# EAGLE design ledboard_smallcon_vert_gndplane (EAGLE 6.4)
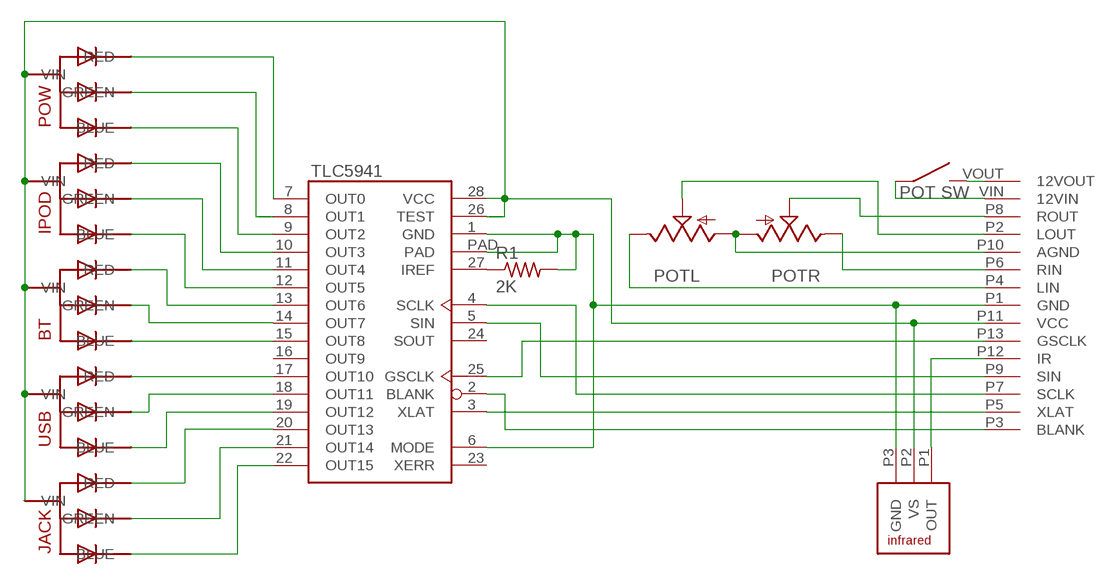
[diagram p0: schematic, sheet 1]

## Parts
BT  5MMRGBLEDBENT  [BENTLED]
IPOD  5MMRGBLEDBENT  [BENTLED]
IR  TSOP323  [TSOP323]
JACK  5MMRGBLEDBENT  [BENTLED]
POT  ALPS_RK0971221Z0N  [ALPS_RK0971221Z0X]
POW  5MMRGBLEDBENT  [BENTLED]
R1  2K  R-US_0207/7  [0207/7]
U$1  TLC5941  [HTSSOP28_POWERPAD]
U$3  CONNECTORSMALL4  [SMALLL4]
USB  5MMRGBLEDBENT  [BENTLED]

## Nets
12VIN: POT.S1 U$3.VIN(12VIN)
12VOUT: POT.S2 U$3.VOUT(12VOUT)
AGND: POT.G1 POT.G2 U$3.P10(AGND)
BLANK: U$1.2(BLANK) U$3.P3(BLANK)
GND: IR.P3(GND) R1.2 U$1.1(GND) U$1.6(MODE) U$1.PAD U$3.P1(GND)
GSCLK: U$1.25(GSCLK) U$3.P13(GSCLK)
IR: IR.P1(OUT) U$3.P12(IR)
LIN: POT.I1 U$3.P4(LIN)
LOUT: POT.O1 U$3.P2(LOUT)
N1: POW.P$1(BLUE) U$1.9(OUT2)
N$2: POW.P$4(RED) U$1.7(OUT0)
N$3: POW.P$2(GREEN) U$1.8(OUT1)
N$5: IPOD.P$4(RED) U$1.10(OUT3)
N$6: IPOD.P$2(GREEN) U$1.11(OUT4)
N$7: IPOD.P$1(BLUE) U$1.12(OUT5)
N$8: BT.P$4(RED) U$1.13(OUT6)
N$9: BT.P$1(BLUE) U$1.15(OUT8)
N$10: U$1.19(OUT12) USB.P$1(BLUE)
N$11: JACK.P$1(BLUE) U$1.22(OUT15)
N$12: BT.P$2(GREEN) U$1.14(OUT7)
N$13: U$1.17(OUT10) USB.P$4(RED)
N$15: JACK.P$4(RED) U$1.20(OUT13)
N$17: U$1.18(OUT11) USB.P$2(GREEN)
N$18: JACK.P$2(GREEN) U$1.21(OUT14)
N$19: R1.1 U$1.27(IREF)
RIN: POT.I2 U$3.P6(RIN)
ROUT: POT.O2 U$3.P8(ROUT)
SCLK: U$1.4(SCLK) U$3.P7(SCLK)
SIN: U$1.5(SIN) U$3.P9(SIN)
VCC: BT.P$3(VIN) IPOD.P$3(VIN) IR.P2(VS) JACK.P$3(VIN) POW.P$3(VIN) U$1.26(TEST) U$1.28(VCC) U$3.P11(VCC) USB.P$3(VIN)
XLAT: U$1.3(XLAT) U$3.P5(XLAT)
Unconnected: U$1.16(OUT9) U$1.23(XERR) U$1.24(SOUT)

## Library data of the parts
BT IPOD JACK POW USB = led_rgb:5MMRGBLED
IR = tsop321:TSOP323
POT = audio-pots:ALPS_RK0971221Z0*: ALPS RK0971221Z Dual-gang 9mm potentiometer for volume control, with SPST switch -05 model: 10K with "volume" taper -0N model: 50K with traditional audio taper
R1 = resistor:R-US_: RESISTOR, American symbol
U$1 = tlc594X:TLC5941
U$3 = connector:CONNECTOR

## Board
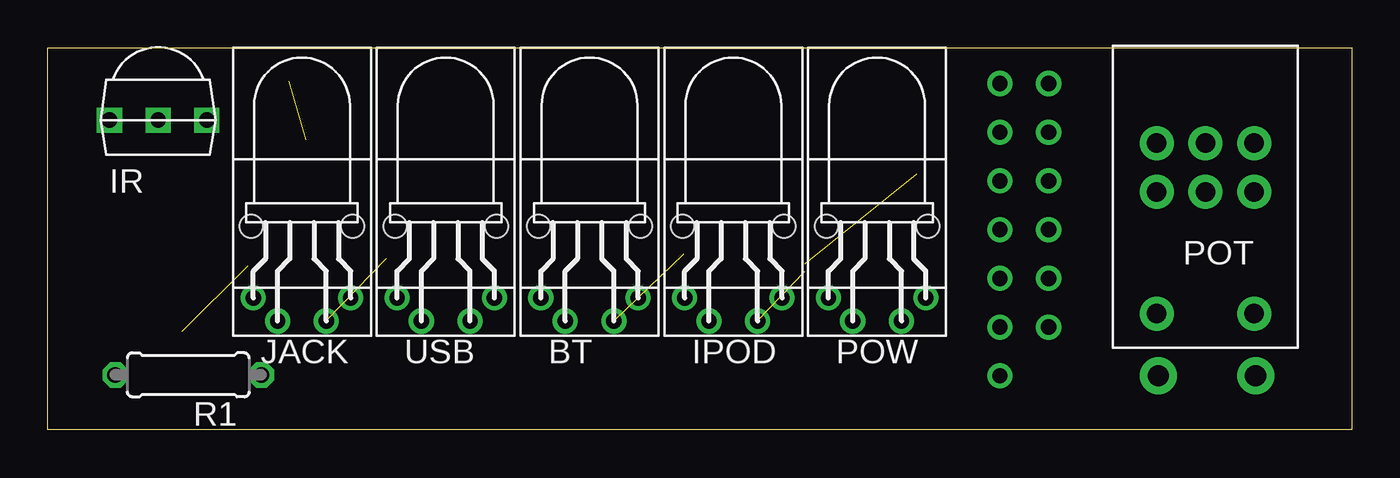
[diagram p1: board, top side]
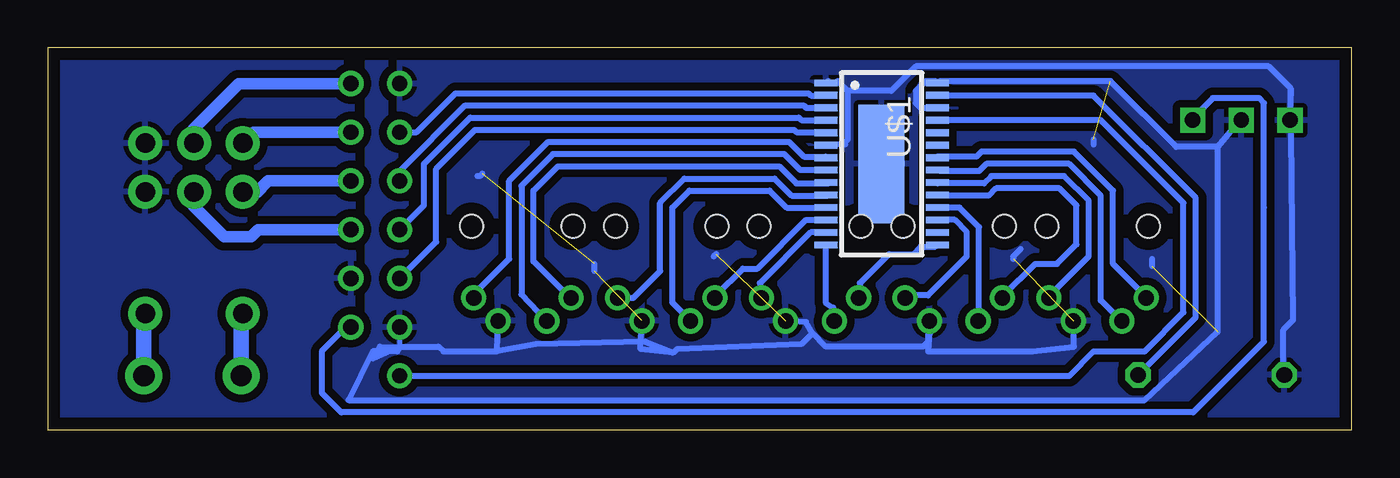
[diagram p2: board, bottom side, seen from below]

Size 68 x 19.9 mm. Coordinates in mm from the lower left corner, seen from the top.
Outline: 0,0 0,19.9 68,19.9 68,0 0,0
Copper layers (1*16): Top 0.035mm / dielectric 1.5mm / Bottom 0.035mm
Design rules "default *": minimum track width 10mil, minimum drill 24mil, track to track 12mil, track to pad 8mil, pad to pad 8mil, via to via 8mil, smd to smd 8mil, copper to edge 25mil, drill to drill 8mil, minimum pad ring 10mil, minimum via ring 8mil, stop-mask expansion 4mil, vias tented up to drill 0mil, thermal gap 10mil

### Footprints (pad centres in the part's own frame; a part is rotated, then mirrored left to right if it is on the bottom)
BENTLED = drill 0.8: P$1 -2.54,-0.381; P$2 -1.27,-1.587; P$3 1.27,-1.587; P$4 2.54,-0.381 | hole 1.2: -2.65,3.35; 2.65,3.35
TSOP323 = drill 0.8 square: P1 2.54,0; P2 0,0; P3 -2.54,0
ALPS_RK0971221Z0X = drill 1.016 pad 1.778: G1 2.54,-2.54; G2 0,-2.54; I1 2.54,2.54; I2 0,2.54; O1 2.54,0; O2 0,0; S1 -6.35,-2.54; S2 -6.35,2.54
0207/7 = drill 0.813 octagon: 1 -3.81,0; 2 3.81,0
HTSSOP28_POWERPAD = smd 0.35 x 1.2: 1 -4.225,-2.9; 2 -3.575,-2.9; 3 -2.925,-2.9; 4 -2.275,-2.9; 5 -1.625,-2.9; 6 -0.975,-2.9; 7 -0.325,-2.9; 8 0.325,-2.9; 9 0.975,-2.9; 10 1.625,-2.9; 11 2.275,-2.9; 12 2.925,-2.9; 13 3.575,-2.9; 14 4.225,-2.9; 15 4.225,2.9; 16 3.575,2.9; 17 2.925,2.9; 18 2.275,2.9; 19 1.625,2.9; 20 0.975,2.9; 21 0.325,2.9; 22 -0.325,2.9; 23 -0.975,2.9; 24 -1.625,2.9; 25 -2.275,2.9; 26 -2.925,2.9; 27 -3.575,2.9; 28 -4.225,2.9 | smd 6.17 x 2.4: PAD 0,0
SMALLL4 = drill 0.8: P1 1.27,1.27; P2 1.27,-1.27; P3 -1.27,1.27; P4 -1.27,-1.27; P5 -3.81,1.27; P6 -3.81,-1.27; P7 -6.35,1.27; P8 -6.35,-1.27; P9 -8.89,1.27; P10 -8.89,-1.27; P11 -11.43,1.27; P12 -11.43,-1.27; P13 -13.97,1.27 | drill 1.1 pad 1.93: VIN -13.97,-12.065; VOUT -13.97,-6.985

### Placement (x,y rotation side)
BT  28.25,7.25 0 top
IPOD  35.75,7.25 0 top
IR  5.75,16.14 0 top
JACK  13.25,7.25 0 top
POT  60.38,12.4 90 top
POW  43.25,7.25 0 top
R1  7.32,2.86 180 top
U$1  24.51,13.86 270 bottom
U$3  50.93,16.78 90 top
USB  20.75,7.25 0 top

### Tracks (layer width: path | path; a pad name or v marks a point on that pad's centre or on a via)
12VIN
  Bottom 0.61: 62.99,5.98 POT.S1
  Bottom 0.813: U$3.VIN 62.99,5.98
12VOUT
  Bottom 0.61: 57.91,5.98 POT.S2
  Bottom 0.813: U$3.VOUT 57.91,5.98
AGND
  pour Bottom (isolate 0.406): 52.83,0.65 67.94,0.4 67.94,19.83 52.2,19.7 52.07,7.76 52.2,5.48 53.72,4.08
BLANK
  Bottom 0.305: U$3.P3 48.77,15.51 46.74,17.54 28.32,17.54 28.19,17.41 27.43,17.41 U$1.2
GND
  Bottom 0.305: 3.17,17.8 4.32,18.94 22.73,18.94 24,17.67 26.29,17.67 | 27.3,18.18 U$1.1 26.8,18.08 | 3.17,17.8 3.05,5.73 3.56,5.22 3.56,2.94 R1.2 | 3.17,17.8 IR.P3 | 26.8,18.08 26.7,18.08 | 26.42,14.87 26.48,14.87 | 26.48,14.87 U$1.6 27.56,14.87 | 26.48,14.87 26.54,14.87 26.29,15.13 26.29,17.67 | 26.29,17.67 26.8,18.18 26.8,18.08
  pour Bottom (isolate 0.406): -3.68,21.35 49.66,22.11 49.66,-2.27 -3.68,-3.03
GSCLK
  Bottom 0.305: U$3.P13 14.73,2.81 13.46,4.08 10.79,4.08 8.76,6.11 8.76,11.83 13.08,16.14 20.83,16.14 U$1.25 21.34,16.14
IR
  Bottom 0.305: IR.P1 8.26,16.27 7.24,17.29 4.83,17.29 4.57,17.03 4.57,11.57 4.57,4.59 8.26,0.9 52.7,0.9 53.72,1.92 53.72,4.08 52.7,5.09 U$3.P12
LIN
  Bottom 0.61: U$3.P4 57.28,15.51 57.78,15 POT.I1
LOUT
  Bottom 0.61: U$3.P2 58.04,18.05 60.45,15.64 60.45,15 POT.O1
N1
  Bottom 0.305: U$1.9 27.3,12.84 28.96,12.84 29.84,13.73 41.4,13.73 42.67,12.46 42.67,8.78 40.77,6.87 POW.P$1
N$2
  Bottom 0.305: U$1.7 27.43,14.24 28.57,14.24 29.34,15 41.91,15 43.94,12.97 43.94,8.9 45.85,7 POW.P$4
N$3
  Bottom 0.305: U$1.8 28.76,13.53 29.59,14.37 41.66,14.37 43.31,12.71 43.31,7.06 POW.P$2
N$5
  Bottom 0.305: U$1.10 27.3,12.21 29.21,12.21 30.1,13.1 34.8,13.1 36.07,11.83 36.07,8.27 37.47,6.87 38.23,6.87 IPOD.P$4
N$6
  Bottom 0.305: U$1.11 27.56,11.57 29.46,11.57 30.35,12.46 34.54,12.46 35.43,11.57 35.43,6.62 34.54,5.73 IPOD.P$2
N$7
  Bottom 0.305: U$1.12 27.43,10.94 28.45,10.94 30.99,8.4 31.75,8.4 33.15,7 33.15,6.94 IPOD.P$1
N$8
  Bottom 0.305: U$1.13 28.21,10.28 30.86,7.63 30.86,6.86 BT.P$4
N$9
  Bottom 0.305: U$1.15 21.72,9.54 22.48,9.54 22.86,9.16 24.13,9.16 25.65,7.63 BT.P$1
N$10
  Bottom 0.305: USB.P$1 18.16,6.95 18.16,7 16.5,8.65 15.37,8.65 14.35,9.67 14.35,11.7 15.24,12.59 18.54,12.59 18.92,12.21 21.59,12.21 U$1.19
N$11
  Bottom 0.305: U$1.22 21.59,14.24 19.56,14.24 19.3,14.49 14.48,14.49 12.45,12.46 12.45,8.65 10.67,6.87 JACK.P$1
N$12
  Bottom 0.305: U$1.14 27.43,9.61 27.43,6.62 27.05,6.36 27.05,5.67 27.03,5.65 BT.P$2
N$13
  Bottom 0.305: U$1.17 21.59,10.94 20.7,10.94 20.07,10.3 20.07,9.03 22.1,7 23.24,7 USB.P$4
N$15
  Bottom 0.305: U$1.20 21.59,12.84 19.18,12.84 18.8,13.22 14.99,13.22 13.72,11.95 13.72,9.03 15.75,7 JACK.P$4
N$17
  Bottom 0.305: U$1.18 21.59,11.57 20.45,11.57 19.43,10.56 19.43,6.11 USB.P$2
N$18
  Bottom 0.305: U$1.21 21.46,13.48 19.43,13.48 19.05,13.86 14.73,13.86 13.08,12.21 13.08,6.75 12.06,5.73 JACK.P$2
N$19
  Bottom 0.305: U$1.27 21.59,17.41 13.46,17.41 8.13,12.08 8.13,5.86 10.16,3.82 R1.1
RIN
  Bottom 0.61: U$3.P6 56.52,12.97 57.15,12.33 57.78,12.33 POT.I2
ROUT
  Bottom 0.61: U$3.P8 57.02,10.43 57.4,10.05 58.8,10.05 60.45,11.7 60.45,12.33 POT.O2
SCLK
  Bottom 0.305: U$3.P7 48.39,11.7 48.39,13.86 45.97,16.27 28.83,16.27 28.7,16.14 27.43,16.14 U$1.4
SIN
  Bottom 0.305: U$3.P9 47.75,9.79 47.75,13.6 45.72,15.64 29.08,15.64 28.96,15.51 27.43,15.51 U$1.5
VCC  (6 unrouted)
  Bottom 0.254: 50.67,4.33 49.66,4.33 U$3.P11 49.66,4.21 49.78,4.08
  Bottom 0.305: U$1.26 21.72,16.78 22.48,16.78 22.73,17.03 22.73,17.67 22.23,18.18 21.72,18.18 U$1.28 21.46,18.18 12.57,18.18 9.14,14.75 6.99,14.75 | 6.99,14.75 5.84,16.14 IR.P2 | 6.99,14.75 6.99,5.09 10.79,1.54 52.32,1.54 51.05,4.08 49.78,4.08 | 44.58,4.08 47.37,4.08 47.62,4.33 49.66,4.33 51.05,3.7 50.67,4.33 | JACK.P$3 14.48,4.33 16.64,4.08 22.1,4.08 21.97,5.73 22.1,5.6 | USB.P$3 21.72,5.6 22.1,5.6 | BT.P$3 28.45,5.6 28.13,5.03 | 28.13,5.03 27.43,4.33 22.35,4.33 22.1,4.59 22.1,5.6 | IPOD.P$3 37.08,4.21 35.37,4.01 | 35.37,4.01 35.18,4.21 28.7,4.46 28.13,5.03 | 44.58,4.08 POW.P$3 | 44.58,4.08 42.55,4.46 36.83,4.59 35.37,4.01 | 39.5,8.27 39.5,8.65 | 13.46,15.13 13.46,14.87 | 45.34,13.35 45.47,13.22 45.59,13.22 | 33.15,9.16 33.27,9.03 | 10.41,8.9 10.41,8.52 | 17.27,9.41 17.65,9.03 17.65,8.9
  pour Bottom (isolate 0.406): 6.99,16.78 4.57,16.91 4.57,4.33 7.49,1.03 52.7,1.03 53.59,3.95 51.31,6.11 51.31,19.32 50.42,19.32 50.42,14.62 46.48,17.54 36.45,17.67 27.05,17.16 22.86,17.41 22.35,18.18 12.57,18.18 9.27,14.87 7.62,15.51
XLAT
  Bottom 0.254: U$3.P5 49.66,13.48
  Bottom 0.305: 49.66,13.48 46.23,16.91 28.57,16.91 28.45,16.78 27.43,16.78 U$1.3